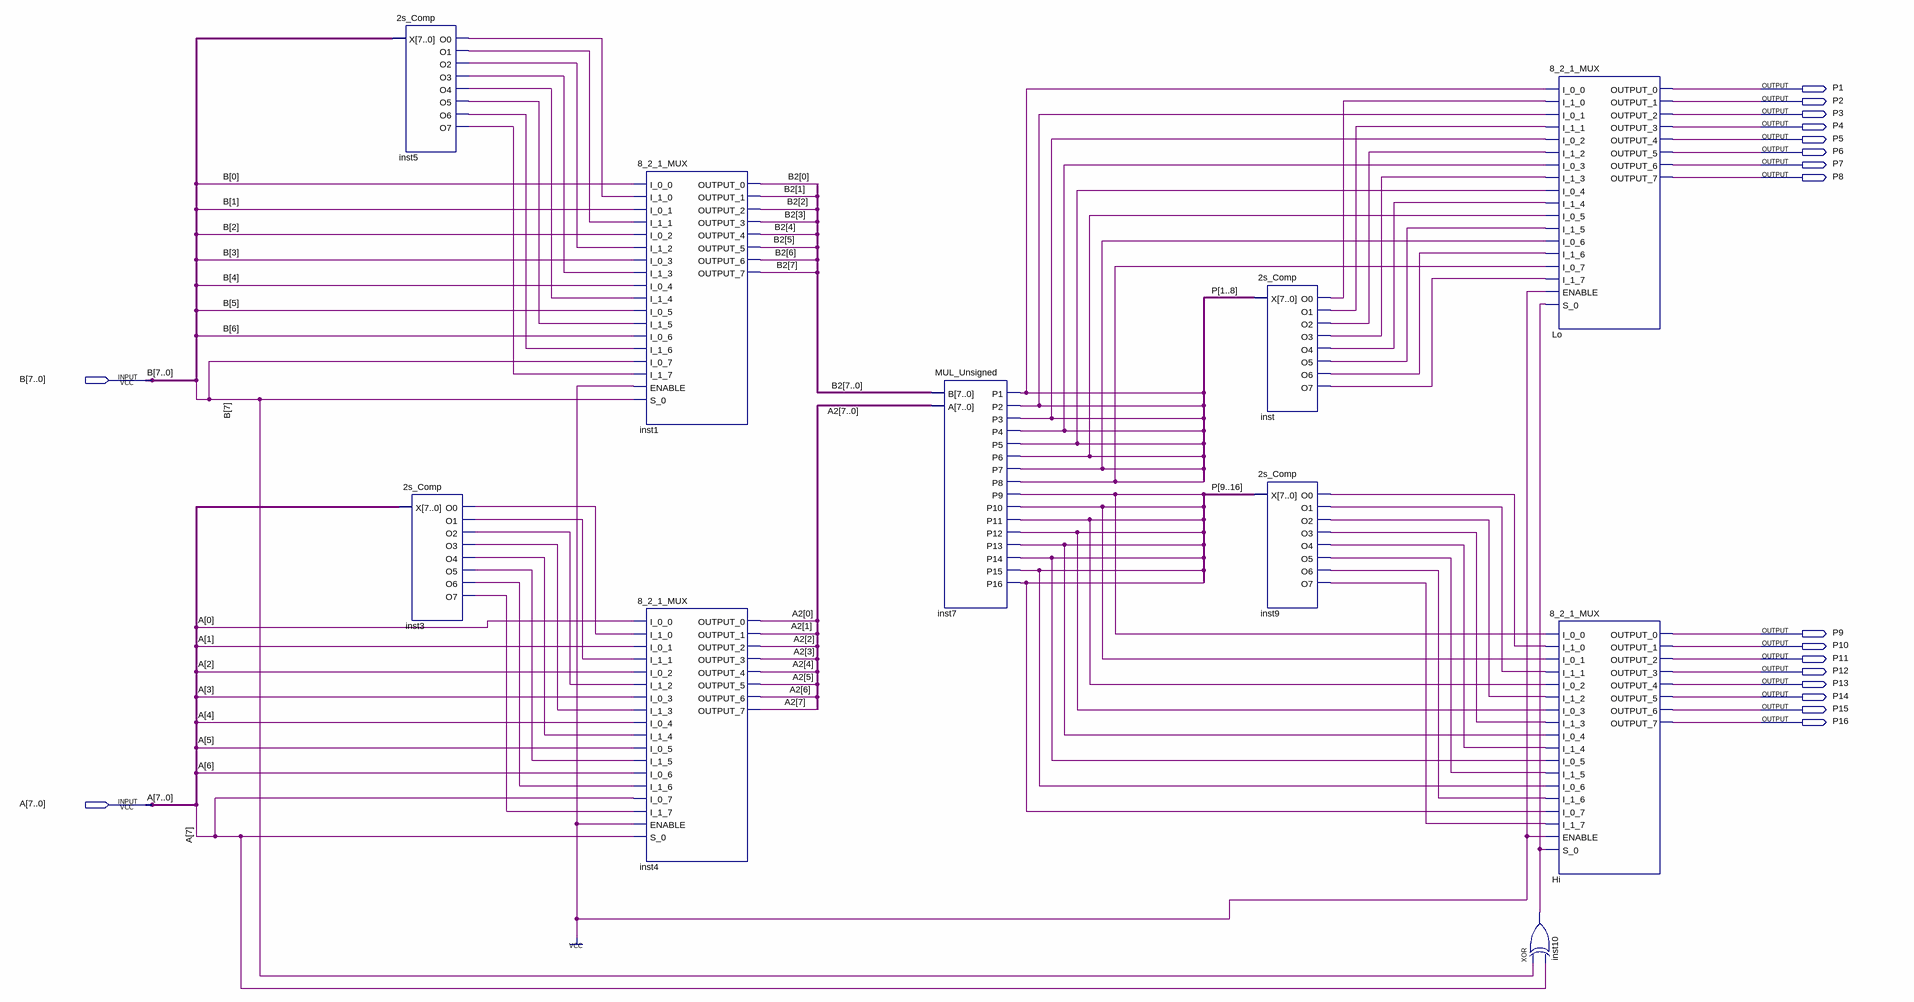
[diagram p0: schematic sheet]
// Quartus schematic MUL-S.bdf as structural Verilog: 10 symbols, 18 pins
module \MUL-S  (
  input  [7:0] B,
  input  [7:0] A,
  output P1,
  output P2,
  output P3,
  output P4,
  output P5,
  output P6,
  output P7,
  output P8,
  output P9,
  output P10,
  output P11,
  output P12,
  output P13,
  output P14,
  output P15,
  output P16
);

  wire inst3_o0, inst3_o1, inst3_o2, inst3_o3, inst3_o4, inst3_o5, inst3_o6, inst3_o7, inst5_o0, inst5_o1,
       inst5_o2, inst5_o3, inst5_o4, inst5_o5, inst5_o6, inst5_o7, inst7_p1, inst7_p2, inst7_p3, inst7_p4,
       inst7_p5, inst7_p6, inst7_p7, inst7_p8, inst7_p9, inst7_p10, inst7_p11, inst7_p12, inst7_p13,
       inst7_p14, inst7_p15, inst7_p16, inst9_o0, inst9_o1, inst9_o2, inst9_o3, inst9_o4, inst9_o5, inst9_o6,
       inst9_o7, inst10_out, inst_o0, inst_o1, inst_o2, inst_o3, inst_o4, inst_o5, inst_o6, inst_o7;
  wire [7:0] A2, B2;

  \2s_Comp  inst5 (
    .X(B), .O0(inst5_o0), .O1(inst5_o1), .O2(inst5_o2), .O3(inst5_o3), .O4(inst5_o4), .O5(inst5_o5),
    .O6(inst5_o6), .O7(inst5_o7));
  \2s_Comp  inst3 (
    .X(A), .O0(inst3_o0), .O1(inst3_o1), .O2(inst3_o2), .O3(inst3_o3), .O4(inst3_o4), .O5(inst3_o5),
    .O6(inst3_o6), .O7(inst3_o7));
  \8_2_1_MUX  inst1 (
    .I_0_0(B[0]), .I_1_0(inst5_o0), .I_0_1(B[1]), .I_1_1(inst5_o1), .I_0_2(B[2]), .I_1_2(inst5_o2),
    .I_0_3(B[3]), .I_1_3(inst5_o3), .I_0_4(B[4]), .I_1_4(inst5_o4), .I_0_5(B[5]), .I_1_5(inst5_o5),
    .I_0_6(B[6]), .I_1_6(inst5_o6), .I_0_7(B[7]), .I_1_7(inst5_o7), .ENABLE(1'b1), .S_0(B[7]),
    .OUTPUT_0(B2[0]), .OUTPUT_1(B2[1]), .OUTPUT_2(B2[2]), .OUTPUT_3(B2[3]), .OUTPUT_4(B2[4]),
    .OUTPUT_5(B2[5]), .OUTPUT_6(B2[6]), .OUTPUT_7(B2[7]));
  \8_2_1_MUX  inst4 (
    .I_0_0(A[0]), .I_1_0(inst3_o0), .I_0_1(A[1]), .I_1_1(inst3_o1), .I_0_2(A[2]), .I_1_2(inst3_o2),
    .I_0_3(A[3]), .I_1_3(inst3_o3), .I_0_4(A[4]), .I_1_4(inst3_o4), .I_0_5(A[5]), .I_1_5(inst3_o5),
    .I_0_6(A[6]), .I_1_6(inst3_o6), .I_0_7(A[7]), .I_1_7(inst3_o7), .ENABLE(1'b1), .S_0(A[7]),
    .OUTPUT_0(A2[0]), .OUTPUT_1(A2[1]), .OUTPUT_2(A2[2]), .OUTPUT_3(A2[3]), .OUTPUT_4(A2[4]),
    .OUTPUT_5(A2[5]), .OUTPUT_6(A2[6]), .OUTPUT_7(A2[7]));
  MUL_Unsigned inst7 (
    .B(B2), .A(A2), .P1(inst7_p1), .P2(inst7_p2), .P3(inst7_p3), .P4(inst7_p4), .P5(inst7_p5), .P6(inst7_p6),
    .P7(inst7_p7), .P8(inst7_p8), .P9(inst7_p9), .P10(inst7_p10), .P11(inst7_p11), .P12(inst7_p12),
    .P13(inst7_p13), .P14(inst7_p14), .P15(inst7_p15), .P16(inst7_p16));
  \2s_Comp  inst (
    .X({P1, P2, P3, P4, P5, P6, P7, P8}), .O0(inst_o0), .O1(inst_o1), .O2(inst_o2), .O3(inst_o3),
    .O4(inst_o4), .O5(inst_o5), .O6(inst_o6), .O7(inst_o7));
  \2s_Comp  inst9 (
    .X({P9, P10, P11, P12, P13, P14, P15, P16}), .O0(inst9_o0), .O1(inst9_o1), .O2(inst9_o2), .O3(inst9_o3),
    .O4(inst9_o4), .O5(inst9_o5), .O6(inst9_o6), .O7(inst9_o7));
  \8_2_1_MUX  Lo (
    .I_0_0(inst7_p1), .I_1_0(inst_o0), .I_0_1(inst7_p2), .I_1_1(inst_o1), .I_0_2(inst7_p3), .I_1_2(inst_o2),
    .I_0_3(inst7_p4), .I_1_3(inst_o3), .I_0_4(inst7_p5), .I_1_4(inst_o4), .I_0_5(inst7_p6), .I_1_5(inst_o5),
    .I_0_6(inst7_p7), .I_1_6(inst_o6), .I_0_7(inst7_p8), .I_1_7(inst_o7), .ENABLE(1'b1), .S_0(inst10_out),
    .OUTPUT_0(P1), .OUTPUT_1(P2), .OUTPUT_2(P3), .OUTPUT_3(P4), .OUTPUT_4(P5), .OUTPUT_5(P6), .OUTPUT_6(P7),
    .OUTPUT_7(P8));
  \8_2_1_MUX  Hi (
    .I_0_0(inst7_p9), .I_1_0(inst9_o0), .I_0_1(inst7_p10), .I_1_1(inst9_o1), .I_0_2(inst7_p11),
    .I_1_2(inst9_o2), .I_0_3(inst7_p12), .I_1_3(inst9_o3), .I_0_4(inst7_p13), .I_1_4(inst9_o4),
    .I_0_5(inst7_p14), .I_1_5(inst9_o5), .I_0_6(inst7_p15), .I_1_6(inst9_o6), .I_0_7(inst7_p16),
    .I_1_7(inst9_o7), .ENABLE(1'b1), .S_0(inst10_out), .OUTPUT_0(P9), .OUTPUT_1(P10), .OUTPUT_2(P11),
    .OUTPUT_3(P12), .OUTPUT_4(P13), .OUTPUT_5(P14), .OUTPUT_6(P15), .OUTPUT_7(P16));
  xor inst10 (inst10_out, B[7], A[7]);
endmodule
